# Altium schematic sheet Đề 10.SchDoc
size A3; SheetNumber: 1; SheetTotal: 1; SPICEModelCacheXDHGJOTF: <root> / <DocumentId>XDHGJOTF</DocumentId> / <CacheFrame Number="0"> / <Model Name="fuse" Kind="CKT"> / <Text>.SUBCKT FUSE 1 2 PARAMS: CURRENT=1 RESISTANCE=1m / SW1 1 2 3 0 SMOD OFF / BNLV 3 0 V=(abs(v(1,2))) / .MODEL SMOD SW (VT={(CURRENT*RESISTANCE)} RON=1g ROFF={RESISTANCE}) / .ENDS FUSE</Text> / </Model> / <Model Name="diode" Kind="MDL"> / <Text>*Default Diode / *Diode Pinout: A,K / .MODEL DIODE D()</Text> / </Model> / <Model Name="skydiode" Kind="MDL"> / <Text>*Default Schottky Diode / *Schottky Diode Pinout: A,K / .MODEL SKYDIODE D(EG=0.69 XTI=2)</Text> / </Model> / <Model Name="irf1010" Kind="CKT"> / <Text>*IRF1010 MCE 4-2-96 / *55V  75A .014 ohm HEXFET pkg:TO-220 2,1,3 / .SUBCKT IRF1010  10 20 40 40 / M1   1  2  3  3  DMOS L=1U W=1U / RD  10  1  5.65M / RS  30  3  1.35M / RG  20  2  12.1 / CGS  2  3  2.15N / EGD 12  0  2  1  1 / VFB 14  0  0 / FFB  2  1  VFB  1 / CGD 13 14  4.49N / R1  13  0  1 / D1  12 13  DLIM / DDG 15 14  DCGD / R2  12 15  1 / D2  15  0  DLIM / DSD  3 10  DSUB / LS  30 40  7.5N / .MODEL DMOS NMOS (LEVEL=3 THETA=60M VMAX=114K ETA=2M VTO=3 KP=19.4) / .MODEL DCGD D (CJO=4.49N VJ=.6 M=.68) / .MODEL DSUB D (IS=311N N=1.5 RS=8.67M BV=55 CJO=4.08N VJ=.8 M=.42 TT=100N) / .MODEL DLIM D (IS=100U) / .ENDS IRF1010</Text> / </Model> / <Model Name="ni3wtrans" Kind="CKT"> / <Text>*Non-ideal 4-winding Transformer / *jjt created 18/1/2001. / *jjt 18/1/2002: changed LX2D,LX3D comments to match subcircuit parameters (X2D, X3D) to avoid possible confusion. / *Connections: / *                 Pri+ / *                 |   Pri- / *                 |   |   Sec1+ / *                 |   |   |   Sec1- / *                 |   |   |   |   Sec2+ / *                 |   |   |   |   |   Sec2- / *                 |   |   |   |   |   | / *                 |   |   |   |   |   | / *                 |   |   |   |   |   | / *                 |   |   |   |   |   | / .SUBCKT NI3WTRANS 1   2   3   4   5   6      PARAMS: RATIO1=1 RATIO2=1 RPRI=0.1 R2D=0.1 R3D=0.1 L1=1U / + X2D=1u X3D=1u XM=1k RCORE=1Meg / VISRC1   4 11 0V / VISRC2   6 14 0V / FCTRL1   10 2 VISRC1 {RATIO1} / FCTRL2   13 2 VISRC2 {RATIO2} / EVCVS1   3 11 10 2 {RATIO1} / EVCVS2   5 14 13 2 {RATIO2} / RRPRI    1 8 {RPRI} / RR2D    9 10 {R2D} / RR3D    12 13 {R3D} / LL1   8 7 {L1} / LX2D  7 9 {X2D} / LX3D  7 12 {X3D} / LXM   7 2 {XM} / RRCORE 7 2 {RCORE} / .ENDS NI3WTRANS</Text> / </Model> / <Model Name="put" Kind="CKT"> / <Text>*Default Programable Unijunction Transistor pkg: TO-92 / *Connections: / *           Anode / *           | Gate / *           | | Cathode / *           | | | / .SUBCKT PUT 1 2 3 / Q1 2 4 3 NMOD / Q2 4 2 1 PMOD / .MODEL NMOD NPN() / .MODEL PMOD PNP() / .ENDS PUT</Text> / </Model> / </CacheFrame> / </root>
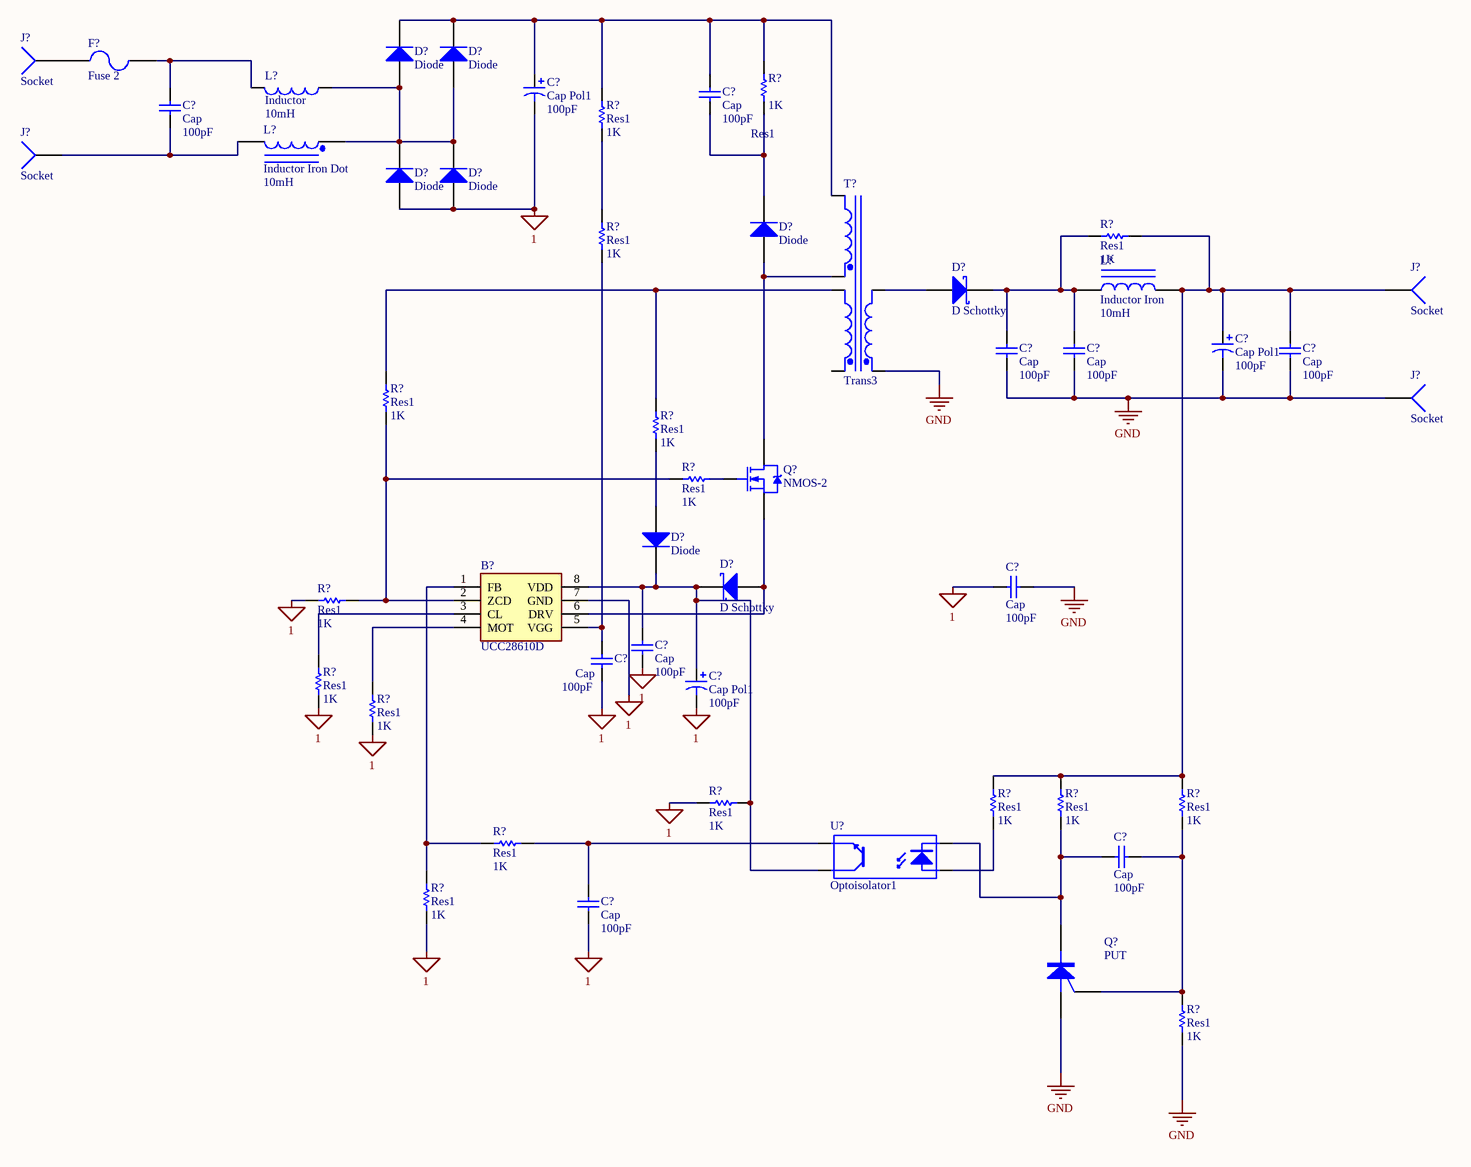
[diagram p0: Đề 10.SchDoc]

## Parts
(Parts that share a designator on the sheet are numbered #1, #2 ... from top to bottom, then left to right.)
B?  UCC28610D  [SOIC127P600X175-8N]
C?#1  Cap Pol1  value 100pF  [RB7.6-15]
C?#2  Cap  value 100pF  [RAD-0.3]
C?#3  Cap  value 100pF  [RAD-0.3]
C?#4  Cap Pol1  value 100pF  [RB7.6-15]
C?#5  Cap  value 100pF  [RAD-0.3]
C?#6  Cap  value 100pF  [RAD-0.3]
C?#7  Cap  value 100pF  [RAD-0.3]
C?#8  Cap  value 100pF  [RAD-0.3]
C?#9  Cap  value 100pF  [RAD-0.3]
C?#10  Cap  value 100pF  [RAD-0.3]
C?#11  Cap Pol1  value 100pF  [RB7.6-15]
C?#12  Cap  value 100pF  [RAD-0.3]
C?#13  Cap  value 100pF  [RAD-0.3]
D?#1  Diode  [SMC]
D?#2  Diode  [SMC]
D?#3  Diode  [SMC]
D?#4  Diode  [SMC]
D?#5  Diode  [SMC]
D?#6  D Schottky  [SMB]
D?#7  Diode  [SMC]
D?#8  D Schottky  [SMB]
F?  Fuse 2  [PIN-W2/E2.8]
J?#1  Socket  [PIN1]
J?#2  Socket  [PIN1]
J?#3  Socket  [PIN1]
J?#4  Socket  [PIN1]
L?#1  Inductor  value 10mH  [0402-A]
L?#2  Inductor Iron Dot  value 10mH  [DIODE_SMC]
L?#3  Inductor Iron  value 10mH  [AXIAL-0.9]
Q?#1  NMOS-2  [TO-220AB]
Q?#2  PUT  [TO-52]
R?#1  Res1  value 1K  [AXIAL-0.3]
R?#2  Res1  value 1K  [AXIAL-0.3]
R?#3  Res1  value 1K  [AXIAL-0.3]
R?#4  Res1  value 1K  [AXIAL-0.3]
R?#5  Res1  value 1K  [AXIAL-0.3]
R?#6  Res1  value 1K  [AXIAL-0.3]
R?#7  Res1  value 1K  [AXIAL-0.3]
R?#8  Res1  value 1K  [AXIAL-0.3]
R?#9  Res1  value 1K  [AXIAL-0.3]
R?#10  Res1  value 1K  [AXIAL-0.3]
R?#11  Res1  value 1K  [AXIAL-0.3]
R?#12  Res1  value 1K  [AXIAL-0.3]
R?#13  Res1  value 1K  [AXIAL-0.3]
R?#14  Res1  value 1K  [AXIAL-0.3]
R?#15  Res1  value 1K  [AXIAL-0.3]
R?#16  Res1  value 1K  [AXIAL-0.3]
R?#17  Res1  value 1K  [AXIAL-0.3]
T?  Trans3  [TRF_6]
U?  Optoisolator1  [DIP-4]

## Nets
1: B?.7(GND) C?#1.2 C?#8.1 C?#9.1 C?#10.1 C?#11.2 C?#13.1 D?#3.1(A) D?#4.1(A) R?#8.1 R?#9.1 R?#10.1 R?#11.1 R?#16.1
GND: C?#4.2 C?#5.1 C?#6.1 C?#7.1 C?#8.2 J?#4.1 Q?#2.1(A) R?#17.1 T?.1(Pri+)
NetB?_1: B?.1(FB) R?#15.1 R?#16.2
NetB?_2: B?.2(ZCD) R?#5.1 R?#7.1 R?#8.2
NetB?_3: B?.3(CL) R?#9.2
NetB?_4: B?.4(MOT) R?#10.2
NetB?_5: B?.5(VGG) C?#10.2 R?#4.1
NetB?_6: B?.6(DRV) D?#8.1(A) Q?#1.3(S)
NetB?_8: B?.8(VDD) C?#9.2 C?#11.1 D?#7.2(K) D?#8.2(K) R?#11.2 U?.4(C)
NetC?#1_1: C?#1.1 C?#2.2 D?#1.2(K) D?#2.2(K) R?#1.2 R?#2.2 T?.6(Sec2-)
NetC?#2_1: C?#2.1 D?#5.2(K) R?#1.1
NetC?#3_1: C?#3.1 J?#2.1 L?#2.2
NetC?#3_2: C?#3.2 F?.2 L?#1.2
NetC?#4_1: C?#4.1 C?#7.2 J?#3.1 L?#3.2 R?#3.2 R?#12.2 R?#13.2 R?#14.2
NetC?#5_2: C?#5.2 C?#6.2 D?#6.2(K) L?#3.1 R?#3.1
NetC?#12_1: C?#12.1 Q?#2.3(K) R?#13.1 U?.2(K)
NetC?#12_2: C?#12.2 Q?#2.2(G) R?#14.1 R?#17.2
NetC?#13_2: C?#13.2 R?#15.2 U?.3(E)
NetD?#1_1: D?#1.1(A) D?#2.1(A) D?#3.2(K) D?#4.2(K) L?#1.1 L?#2.1
NetD?#5_1: D?#5.1(A) Q?#1.2(D) T?.5(Sec2+)
NetD?#6_1: D?#6.1(A) T?.2(Pri-)
NetD?#7_1: D?#7.1(A) R?#6.1
NetF?_1: F?.1 J?#1.1
NetQ?#1_1: Q?#1.1(G) R?#7.2
NetR?#2_1: R?#2.1 R?#4.2
NetR?#5_2: R?#5.2 R?#6.2 T?.4(Sec1-)
NetR?#12_1: R?#12.1 U?.1(A)

Not connected (* = marked no-connect by the designer): T? 3(Sec1+)

## Library data of the parts
B? = UCC28610D: Texas Instruments UCC28610D, Buck Controller, - 5  +1.5 A, 130 kHz, 9  20 V, 8-Pin SOIC; Geometry.Height: 1.75mm; Manufacturer_Name: Texas Instruments; Manufacturer_Part_Number: UCC28610D; Mouser Part Number: 595-UCC28610D; Mouser Price/Stock: https://www.mouser.com/Search/Refine.aspx?Keyword=595-UCC28610D; Arrow Part Number: UCC28610D; Arrow Price/Stock: https://www.arrow.com/en/products/ucc28610d/texas-instruments; Datasheet Link: http://www.ti.com/lit/gpn/UCC28610
C?#1 C?#4 C?#11 = Cap Pol1: Polarized Capacitor (Radial); Published: 8-Jun-2000; LatestRevisionDate: 17-Jul-2002; LatestRevisionNote: Re-released for DXP Platform.; PackageReference: RB7.6-15; Publisher: Altium Limited; PackageDescription: Polarized Capacitor (Radial); 2 Leads
C?#2 C?#3 C?#5-C?#10 C?#12 C?#13 = Cap: Capacitor; Published: 8-Jun-2000; LatestRevisionDate: 17-Jul-2002; LatestRevisionNote: Re-released for DXP Platform.; PackageReference: RAD-0.3; Publisher: Altium Limited; PackageDescription: Radial Cap, Thru-Hole; 2 Leads; 0.3 in Pin Spacing
D?#1-D?#5 D?#7 = Diode: Default Diode; Published: 8-Jun-2000; LatestRevisionDate: 17-Jul-2002; LatestRevisionNote: Re-released for DXP Platform.; PackageVersion: Sep-1996; PackageReference: SMC; Publisher: Altium Limited; PackageDescription: DO-214-AB/SMC; 2 C-Bend Leads; Body 7.9 x 5.9 mm, inc. leads (LxW); Code_JEDEC: DO-214-AB
D?#6 D?#8 = D Schottky: Schottky Diode; Published: 8-Jun-2000; LatestRevisionDate: 17-Jul-2002; LatestRevisionNote: Re-released for DXP Platform.; PackageReference: SMB; Publisher: Altium Limited; PackageDescription: DO-214-AA/SMB; 2 C-Bend Leads; Body 5.3 x 3.6 mm, inc. leads (LxW); Code_JEDEC: DO-214-AA
F? = Fuse 2: Fuse; Published: 8-Jun-2000; LatestRevisionDate: 17-Jul-2002; LatestRevisionNote: Re-released for DXP Platform.; PackageReference: PIN-W2/E2.8; Publisher: Altium Limited; PackageDescription: Thru-Hole; 2 Leads
L?#1 = Inductor: Code_IEC: 1005; Published: 8-Jun-2000; LatestRevisionDate: 29-May-2009; LatestRevisionNote: IPC-7351 Footprint Added.; PackageReference: 0402-A; Publisher: Altium Limited; PackageDescription: Chip Inductor; Code_JEITA: 0402
L?#2 = Inductor Iron Dot: Magnetic-Core Inductor with Winding Polarity Marking; Published: 24-Mar-1999; LatestRevisionDate: 17-Jul-2002; LatestRevisionNote: Re-released for DXP Platform.; PackageReference: DIODE_SMC; Publisher: Altium Limited; PackageDescription: Diode; 2 Leads
L?#3 = Inductor Iron: Magnetic-Core Inductor; Published: 24-Mar-1999; LatestRevisionDate: 17-Jul-2002; LatestRevisionNote: Re-released for DXP Platform.; PackageReference: AXIAL-0.9; Publisher: Altium Limited; PackageDescription: Axial Device, Thru-Hole; 2 Leads; 0.9 in Pin Spacing
Q?#1 = NMOS-2: N-Channel Power MOSFET; Note: Pin 2 is electrically connected to pin 4.; Published: 8-Jun-2000; LatestRevisionDate: 17-Jul-2002; LatestRevisionNote: Re-released for DXP Platform.; DatasheetVersion: PD-9.814; PackageVersion: Feb-1997; PackageReference: TO-220AB; Publisher: Altium Limited; PackageDescription: TO, Thru-Hole, Vertical, Heatsink Mounted; 3 In-Line Leads; Pitch 2.54 mm; ComponentLink1Description: Manufacturer Link; ComponentLink1URL: http://www.irf.com/
Q?#2 = PUT: Programmable Unijunction Transistor; Published: 8-Jun-2000; LatestRevisionDate: 17-Jul-2002; LatestRevisionNote: Re-released for DXP Platform.; PackageReference: TO-52; Publisher: Altium Limited; PackageDescription: Can; 3 Leads; Pin Circle Dia. 2.54 mm; Lead Dia. 0.48 mm (max)
R?#1-R?#17 = Res1: Resistor; Published: 8-Jun-2000; LatestRevisionDate: 17-Jul-2002; LatestRevisionNote: Re-released for DXP Platform.; PackageReference: AXIAL-0.3; Publisher: Altium Limited; PackageDescription: Axial Device, Thru-Hole; 2 Leads; 0.3 in Pin Spacing
T? = Trans3: Three-winding Transformer (Non-Ideal); Sim Note: Enter the turns ratios, Core loss resistance, Magnetising Reactance, Leakage Reactances and Resistances referred to the primary side into the parameter fields.; Published: 25-Jan-2001; LatestRevisionDate: 17-Jul-2002; LatestRevisionNote: Re-released for DXP Platform.; PackageReference: TRF_6; Publisher: Altium Limited; PackageDescription: Transformer; 6 Leads
U? = Optoisolator1: 4-Pin Phototransistor Optocoupler; Published: 24-Mar-1999; LatestRevisionDate: 04-Mar-2005; LatestRevisionNote: Sch pins 3 & 4 Swapped.; DatasheetVersion: Nov-2003; PackageReference: DIP-4; Publisher: Altium Limited
J?#1-J?#4 = Socket: LatestRevisionDate: 17-Jul-2002; LatestRevisionNote: Re-released for DXP Platform.; Publisher: Altium Limited